# EAGLE design tutorial4 (EAGLE 9.6.2)
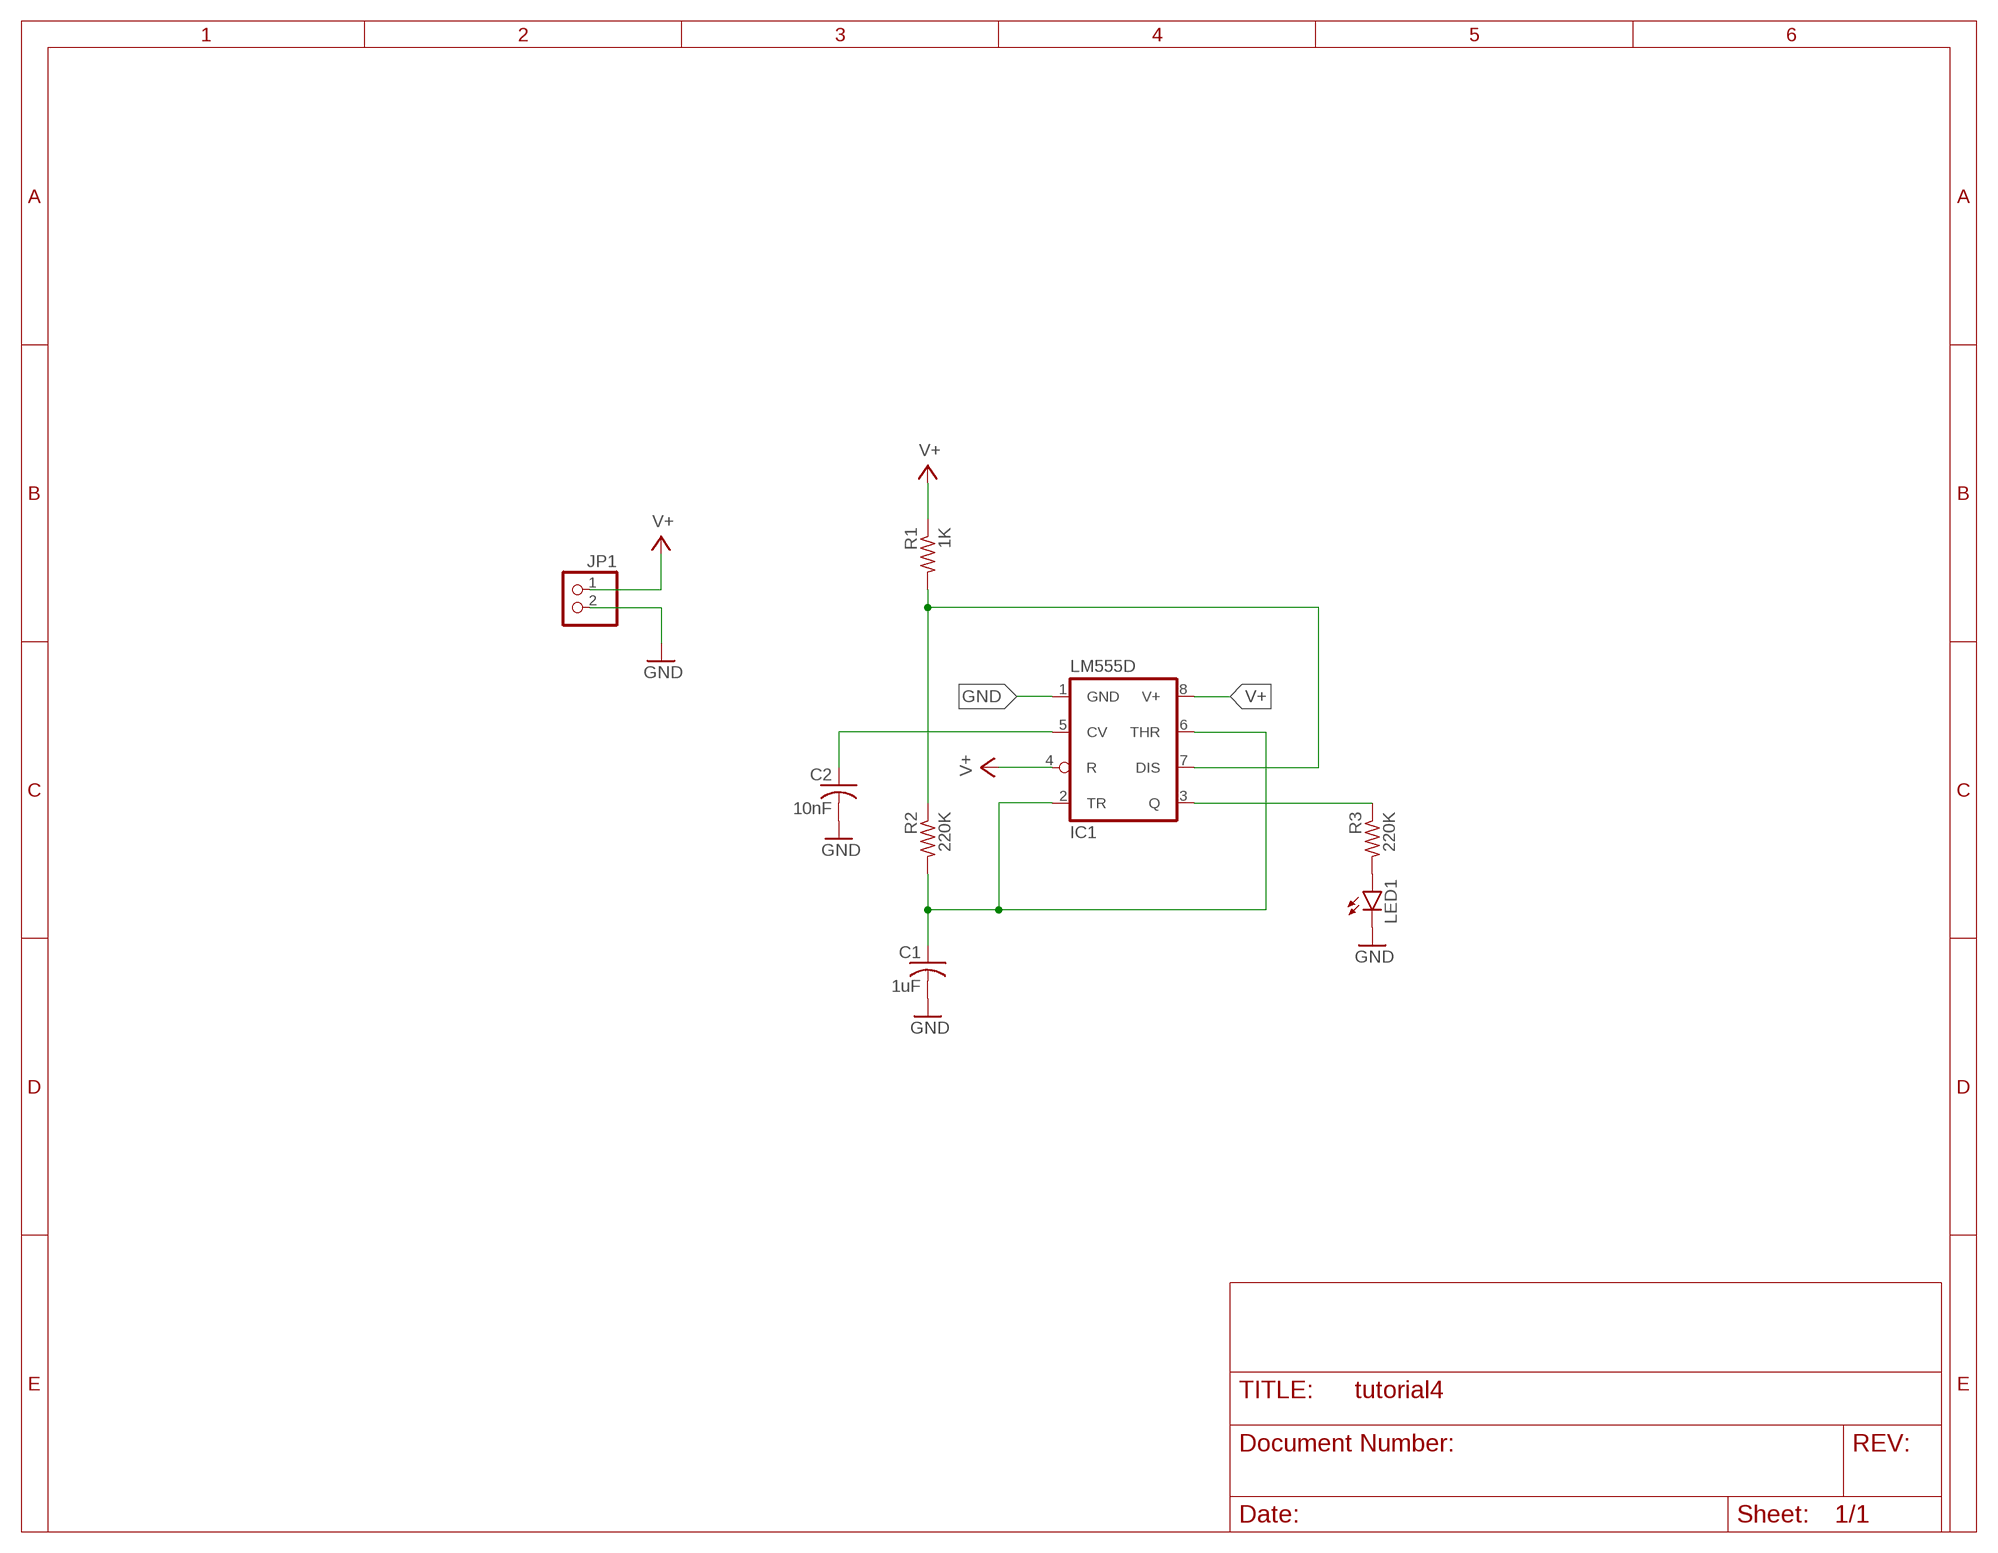
[diagram p0: schematic, sheet 1]

## Parts
C1  1uF  C-USC0603  [C0603]
C2  10nF  C-USC0603  [C0603]
IC1  LM555D  [SO08]
JP1  PINHD-1X2  [1X02]
LED1  LED5MM  [LED5MM]
R1  1K  R-US_R0603  [R0603]
R2  220K  R-US_R0603  [R0603]
R3  220K  R-US_R0603  [R0603]

## Nets
GND: C1.2 C2.2 IC1.1(GND) JP1.2 LED1.K(C)
N$2: C1.1 IC1.2(TR) IC1.6(THR) R2.2
N$3: IC1.7(DIS) R1.2 R2.1
N$4: IC1.3(Q) R3.1
N$5: C2.1 IC1.5(CV)
N$6: LED1.A R3.2
V+: IC1.4(R) IC1.8(V+) JP1.1 R1.1

## Library data of the parts
C1 C2 = rcl:C-US: CAPACITOR, American symbol; SPICEPREFIX: C
IC1 = linear:*555: TIMER
JP1 = pinhead:PINHD-1X2: PIN HEADER
LED1 = led:LED: LED OSRAM: - CHIPLED LG R971, LG N971, LY N971, LG Q971, LY Q971, LO R971, LY R971 LH N974, LH R974 LS Q976, LO Q976, LY Q976 LO Q996 - Hyper CHIPLED LW Q18S LB Q993, LB Q99A, LB R99A - SideLED LS A670, LO A670, LY A670, LG A670, LP A670 LB A673, LV A673, LT A673, LW A673 LH A674 LY A675 LS A676, LA A676, LO A676, LY A676, LW A676 LS A679, LY A679, LG A679 - Hyper Micro SIDELED® LS Y876, LA Y876, LO Y876, LY Y876 LT Y87S - SmartLED LW L88C, LW L88S LB L89C, LB L89S, LG L890 LS L89K, LO L89K, LY L89K LS L896, LA L896, LO L896, LY L896 - TOPLED LS T670, LO T670, LY T670, LG T670, LP T670 LSG T670, LSP T670, LSY T670, LOP T670, LYG T670 LG T671, LOG T671, LSG T671 LB T673, LV T673, LT T673, LW T673 LH T674 LS T676, LA T676, LO T676, LY T676, LB T676, LH T676, LSB T676, LW T676 LB T67C, LV T67C, LT T67C, LS T67K, LO T67K, LY T67K, LW E67C LS E67B, LA E67B, LO E67B, LY E67B, LB E67C, LV E67C, LT E67C LW T67C LS T679, LY T679, LG T679 LS T770, LO T770, LY T770, LG T770, LP T770 LB T773, LV T773, LT T773, LW T773 LH T774 LS E675, LA E675, LY E675, LS T675 LS T776, LA T776, LO T776, LY T776, LB T776 LHGB T686 LT T68C, LB T68C - Hyper Mini TOPLED® LB M676 - Mini TOPLED Santana® LG M470 LS M47K, LO M47K, LY M47K Source: http://www.osram.convergy.de LUXEON: - LUMILED® LXK2-PW12-R00, LXK2-PW12-S00, LXK2-PW14-U00, LXK2-PW14-V00 LXK2-PM12-R00, LXK2-PM12-S00, LXK2-PM14-U00 LXK2-PE12-Q00, LXK2-PE12-R00, LXK2-PE12-S00, LXK2-PE14-T00, LXK2-PE14-U00 LXK2-PB12-K00, LXK2-PB12-L00, LXK2-PB12-M00, LXK2-PB14-N00, LXK2-PB14-P00, LXK2-PB14-Q00 LXK2-PR12-L00, LXK2-PR12-M00, LXK2-PR14-Q00, LXK2-PR14-R00 LXK2-PD12-Q00, LXK2-PD12-R00, LXK2-PD12-S00 LXK2-PH12-R00, LXK2-PH12-S00 LXK2-PL12-P00, LXK2-PL12-Q00, LXK2-PL12-R00 Source: www.luxeon.com KINGBRIGHT: KA-3528ASYC Source: www.kingbright.com
R1-R3 = rcl:R-US_: RESISTOR, American symbol; SPICEPREFIX: R

## Board
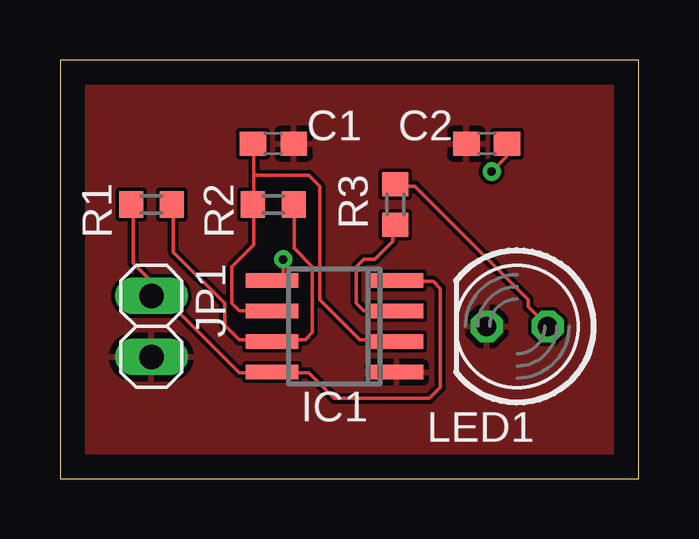
[diagram p1: board, top side]
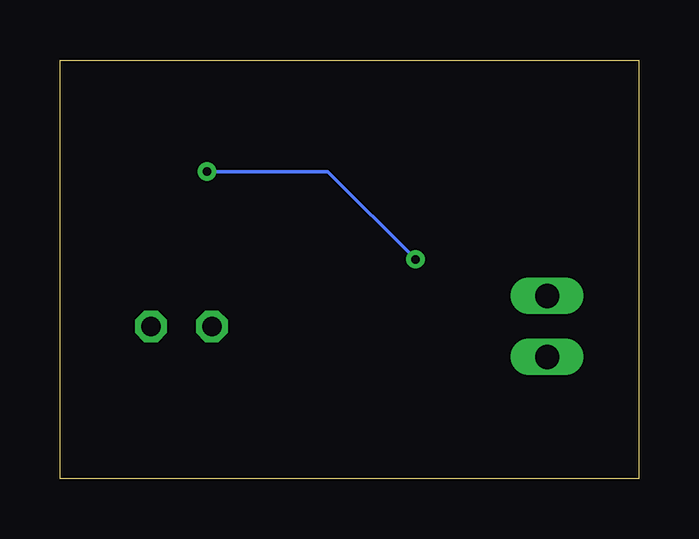
[diagram p2: board, bottom side, seen from below]

Size 24.11 x 17.45 mm. Coordinates in mm from the lower left corner, seen from the top.
Outline: 0,0 24.11,0 24.11,17.45 0,17.45 0,0
Copper layers (1*16): Top 0.035mm / dielectric 1.5mm / Bottom 0.035mm
Design rules "default": minimum track width 6mil, minimum drill 0.35mm, track to track 6mil, track to pad 6mil, pad to pad 6mil, via to via 6mil, smd to smd 6mil, copper to edge 40mil, drill to drill 6mil, minimum pad ring 10mil, minimum via ring 8mil, stop-mask expansion 4mil, vias tented up to drill 0mil, thermal gap 10mil

### Footprints (pad centres in the part's own frame; a part is rotated, then mirrored left to right if it is on the bottom)
C0603 = smd 1.1 x 1: 1 -0.85,0; 2 0.85,0
SO08 = smd 0.6 x 2.2: 1 -1.905,-2.6; 2 -0.635,-2.6; 3 0.635,-2.6; 4 1.905,-2.6; 5 1.905,2.6; 6 0.635,2.6; 7 -0.635,2.6; 8 -1.905,2.6
1X02 = drill 1.016 long: 1 -1.27,0; 2 1.27,0
LED5MM = drill 0.813 octagon: A -1.27,0; K 1.27,0
R0603 = smd 1 x 1.1: 1 -0.85,0; 2 0.85,0

### Placement (x,y rotation side)
C1  8.89,13.97 0 top
C2  17.78,13.97 180 top
IC1  11.43,6.35 90 top
JP1  3.81,6.35 270 top
LED1  19.05,6.35 180 top
R1  3.81,11.43 0 top
R2  8.89,11.43 180 top
R3  13.97,11.43 90 top

### Tracks (layer width: path | path; a pad name or v marks a point on that pad's centre or on a via)
GND
  pour Top: 0,17.4 0,0 24.13,0 24.13,17.4
N$2
  Top 0.152: 8.08,12.65 8.08,13.87 C1.1 | 8.08,12.65 8.08,11.43 | 8.08,11.43 8.08,9.75 7.16,8.84 7.16,7.32 7.47,7.01 8.69,7.01 IC1.6 | 8.08,11.43 R2.2 | 8.08,12.65 10.36,12.65 10.82,12.19 10.82,7.47 12.5,5.79 14.02,5.79 IC1.2
N$3
  Top 0.152: R1.2 4.72,11.43 4.72,9.45 6.86,7.32 6.86,6.4 7.47,5.79 8.69,5.79 IC1.7 8.84,5.79 10.21,5.79 10.52,6.1 10.52,8.84 9.75,9.6 9.75,11.43 R2.1
N$4
  Top 0.152: R3.1 13.87,10.52 13.87,9.91 13.11,9.14 12.65,9.14 12.34,8.84 12.34,7.32 12.65,7.01 14.02,7.01 IC1.3
N$5  (via drill 0.35)
  Top 0.152: v17.98,12.8 18.59,13.41 18.59,13.87 C2.1 | v9.3,9.14 9.3,8.53 9.14,8.38 8.84,8.38 IC1.5
  Bottom 0.152: v17.98,12.8 12.95,12.8 v9.3,9.14
N$6
  Top 0.152: LED1.A 19.51,7.16 19.51,7.47 14.78,12.19 14.02,12.19 R3.2
V+
  Top 0.152: R1.1 3.05,11.43 3.05,8.99 3.81,8.23 JP1.1 4.27,7.62 7.47,4.42 8.69,4.42 IC1.8 8.84,4.42 10.36,4.42 11.43,3.35 15.39,3.35 15.85,3.81 15.85,7.92 15.54,8.23 14.17,8.23 IC1.4